# Altium schematic sheet Charger_MCU_V01.SchDoc
size A4
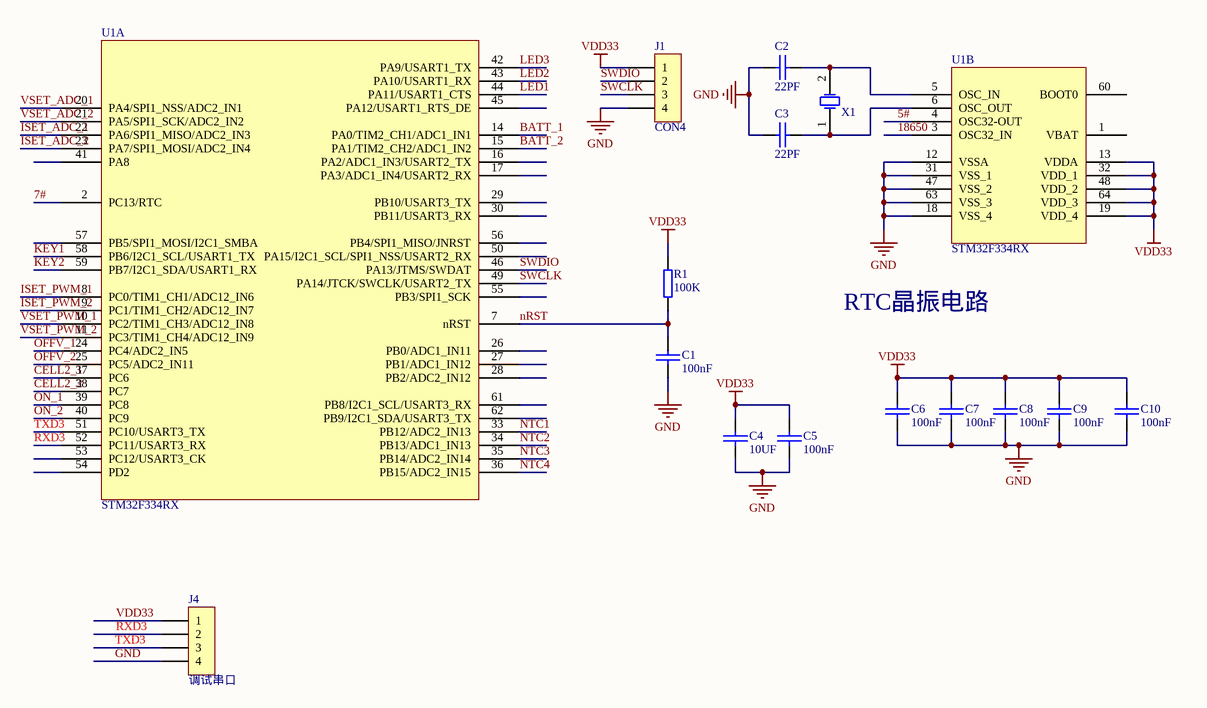
[diagram p0: Charger_MCU_V01.SchDoc]

## Parts
C1  value 100nF  [C0603]  (hidden comment: CC0603ZRY5V9BB104)
C2  value 22PF  [C0603]  (hidden comment: C0603)
C3  value 22PF  [C0603]  (hidden comment: C0603)
C4  value 10UF  [C0603]  (hidden comment: CC0603ZRY5V9BB106)
C5  value 100nF  [C0603]  (hidden comment: CC0603ZRY5V9BB104)
C6  value 100nF  [C0603]  (hidden comment: CC0603ZRY5V9BB104)
C7  value 100nF  [C0603]  (hidden comment: CC0603ZRY5V9BB104)
C8  value 100nF  [C0603]  (hidden comment: CC0603ZRY5V9BB104)
C9  value 100nF  [C0603]  (hidden comment: CC0603ZRY5V9BB104)
C10  value 100nF  [C0603]  (hidden comment: CC0603ZRY5V9BB104)
J1  CON4  [SIP4]
J4  调试串口  [SIP4]
R1  value 100K  [R0603]  (hidden comment: R0603)
U1  value STM32F334RX  [LQFP64]  (hidden comment: STM32F103R8T6)  (parts A,B of 2)
X1  9C-8.000MBBK-T  [XTAL2]  (value not drawn)

## Nets
GND: C1.2 C2.1 C3.1 C4.2 C5.2 C6.2 C7.2 C8.2 C9.2 C10.2 J1.4 J4.4 U1.12(VSSA) U1.18(VSS_4) U1.31(VSS_1) U1.47(VSS_2) U1.63(VSS_3)
VDD33: C4.1 C5.1 C6.1 C7.1 C8.1 C9.1 C10.1 J1.1 J4.1 R1.2 U1.13(VDDA) U1.19(VDD_4) U1.32(VDD_1) U1.48(VDD_2) U1.64(VDD_3)
5#: U1.4(OSC32-OUT)
7#: U1.2(PC13/RTC)
18650: U1.3(OSC32_IN)
BATT_1: U1.14(PA0/TIM2_CH1/ADC1_IN1)
BATT_2: U1.15(PA1/TIM2_CH2/ADC1_IN2)
CELL2_1: U1.37(PC6)
CELL2_2: U1.38(PC7)
ISET_ADC_1: U1.22(PA6/SPI1_MISO/ADC2_IN3)
ISET_ADC_2: U1.23(PA7/SPI1_MOSI/ADC2_IN4)
ISET_PWM_1: U1.8(PC0/TIM1_CH1/ADC12_IN6)
ISET_PWM_2: U1.9(PC1/TIM1_CH2/ADC12_IN7)
KEY1: U1.58(PB6/I2C1_SCL/USART1_TX)
KEY2: U1.59(PB7/I2C1_SDA/USART1_RX)
LED1: U1.44(PA11/USART1_CTS)
LED2: U1.43(PA10/USART1_RX)
LED3: U1.42(PA9/USART1_TX)
nRST: C1.1 R1.1 U1.7(nRST)
NTC1: U1.33(PB12/ADC2_IN13)
NTC2: U1.34(PB13/ADC1_IN13)
NTC3: U1.35(PB14/ADC2_IN14)
NTC4: U1.36(PB15/ADC2_IN15)
OFFV_1: U1.24(PC4/ADC2_IN5)
OFFV_2: U1.25(PC5/ADC2_IN11)
ON_1: U1.39(PC8)
ON_2: U1.40(PC9)
RXD3: J4.2 U1.52(PC11/USART3_RX)
SWCLK: J1.3 U1.49(PA14/JTCK/SWCLK/USART2_TX)
SWDIO: J1.2 U1.46(PA13/JTMS/SWDAT)
TXD3: J4.3 U1.51(PC10/USART3_TX)
VSET_ADC_1: U1.20(PA4/SPI1_NSS/ADC2_IN1)
VSET_ADC_2: U1.21(PA5/SPI1_SCK/ADC2_IN2)
VSET_PWM_1: U1.10(PC2/TIM1_CH3/ADC12_IN8)
VSET_PWM_2: U1.11(PC3/TIM1_CH4/ADC12_IN9)
NetC2_2: C2.2 U1.5(OSC_IN) X1.2(OSC2)
NetC3_2: C3.2 U1.6(OSC_OUT) X1.1(OSC1)

Not connected (* = marked no-connect by the designer): U1 1(VBAT) 16(PA2/ADC1_IN3/USART2_TX) 17(PA3/ADC1_IN4/USART2_RX) 26(PB0/ADC1_IN11) 27(PB1/ADC1_IN12) 28(PB2/ADC2_IN12) 29(PB10/USART3_TX) 30(PB11/USART3_RX) 41(PA8) 45(PA12/USART1_RTS_DE) 50(PA15/I2C1_SCL/SPI1_NSS/USART2_RX) 53(PC12/USART3_CK) 54(PD2) 55(PB3/SPI1_SCK) 56(PB4/SPI1_MISO/JNRST) 57(PB5/SPI1_MOSI/I2C1_SMBA) 60(BOOT0) 61(PB8/I2C1_SCL/USART3_RX) 62(PB9/I2C1_SDA/USART3_TX)

## Notes on the sheet
- RTC晶振电路

## Library data of the parts
C1 = C0603: CAP CER 0.1UF 50V Y5V 0603; Manufacturer: Yageo; Unit Cost: 0.04; Category: Capacitors; Manufacturer Part Number: CC0603ZRY5V9BB104; Part Number: CC0603ZRY5V9BB104
C2 C3 = C0603: CAP CER 22PF 50V Y5V 0603; Unit Cost: 0.04; Category: Capacitors
C4 = C0603: CAP CER 10UF 50V Y5V 0603; Manufacturer: Yageo; Unit Cost: 0.04; Category: Capacitors; Manufacturer Part Number: CC0603ZRY5V9BB106; Part Number: CC0603ZRY5V9BB106
C5-C10 = C0603: CAP CER 100nF 50V Y5V 0603; Manufacturer: Yageo; Unit Cost: 0.04; Category: Capacitors; Manufacturer Part Number: CC0603ZRY5V9BB104; Part Number: CC0603ZRY5V9BB104
  C6: Subcategory: Ceramic Capacitors
J1 = CON4: 2.54mm 程序下载口
J4 = CON4: 2.54mm dip
R1 = R0603: RES 100K OHM 1/10W 5% 0603 SMD; Manufacturer: Yageo; Unit Cost: 0.005; Category: Resistor; RoHs: Lead free / RoHS Compliant; Subcategory: ThickFilm
U1 = STM32F334RX: MCU ARM 64KB FLASH MEM 64-LQFP; Manufacturer: STMicroelectronics; Unit Cost: 9.5; Category: Integrated Circuits (ICs); Manufacturer Part Number: STM32F103R8T6; Part Number: STM32F103R8T6; RoHs: Lead free / RoHS Compliant; Subcategory: STM32 F1
X1 = CRYSTAL-XTAL2: CRYSTAL 8.000MHZ 20PF SMD; Manufacturer: TXC CORPORATION; Value: 8M; Unit Cost: 0.25; Category: Crystals; Manufacturer Part Number: 9C-8.000MBBK-T; Part Number: 9C-8.000MBBK-T; RoHs: Lead free / RoHS Compliant; Subcategory: HC-49S